# Altium schematic sheet STM32F407 MCU.SchDoc
size A4; SheetNumber: 8; SheetTotal: 10
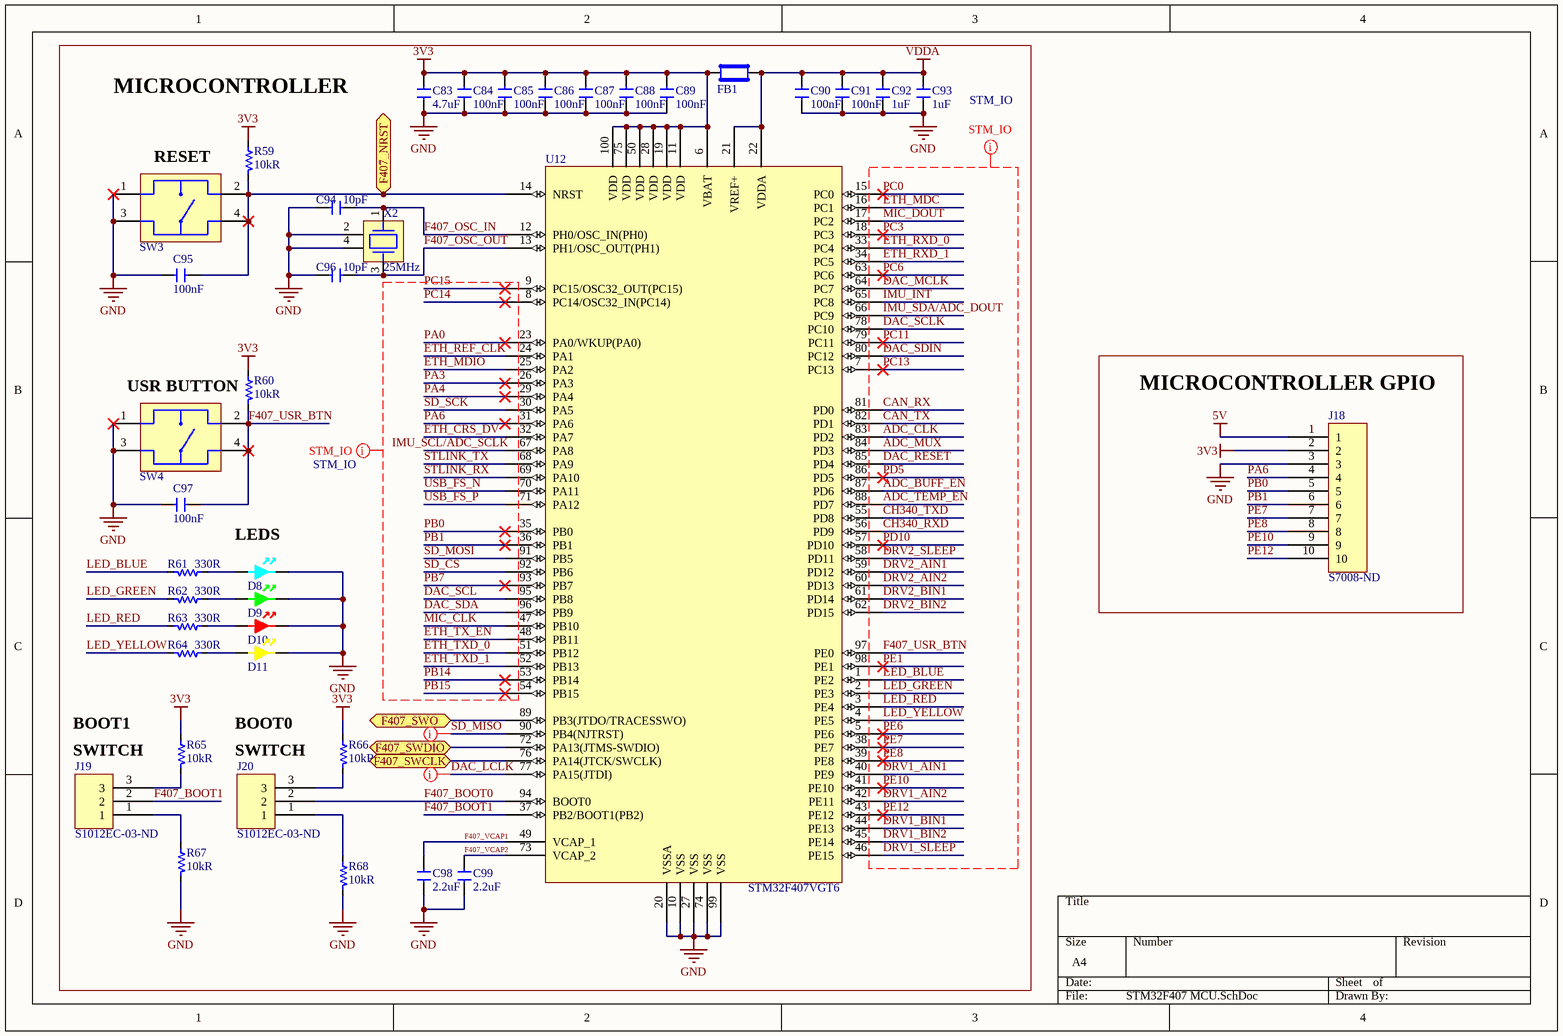
[diagram p0: STM32F407 MCU.SchDoc]

## Parts
C83  Capacitance: 4.7uF  [0805_CAP]  (hidden comment: CAP_4.7uF_%10_0805_25V_X7R_CER)
C84  Capacitance: 100nF  [0805_CAP]  (hidden comment: CAP_0.1uF_%20_50V_0805_X7R_CER)
C85  Capacitance: 100nF  [0805_CAP]  (hidden comment: CAP_0.1uF_%20_50V_0805_X7R_CER)
C86  Capacitance: 100nF  [0805_CAP]  (hidden comment: CAP_0.1uF_%20_50V_0805_X7R_CER)
C87  Capacitance: 100nF  [0805_CAP]  (hidden comment: CAP_0.1uF_%20_50V_0805_X7R_CER)
C88  Capacitance: 100nF  [0805_CAP]  (hidden comment: CAP_0.1uF_%20_50V_0805_X7R_CER)
C89  Capacitance: 100nF  [0805_CAP]  (hidden comment: CAP_0.1uF_%20_50V_0805_X7R_CER)
C90  Capacitance: 100nF  [0805_CAP]  (hidden comment: CAP_0.1uF_%20_50V_0805_X7R_CER)
C91  Capacitance: 100nF  [0805_CAP]  (hidden comment: CAP_0.1uF_%20_50V_0805_X7R_CER)
C92  1uF  [0805_CAP]
C93  1uF  [0805_CAP]
C94  Capacitance: 10pF  [0805_CAP]  (hidden comment: CAP_10pF_%10_0805_50V_C0G/NPO_CER)
C95  Capacitance: 100nF  [0805_CAP]  (hidden comment: CAP_100nF_50V_0805_C0G_CER)
C96  Capacitance: 10pF  [0805_CAP]  (hidden comment: CAP_10pF_%10_0805_50V_C0G/NPO_CER)
C97  Capacitance: 100nF  [0805_CAP]  (hidden comment: CAP_100nF_50V_0805_C0G_CER)
C98  2.2uF  [0805_CAP]
C99  2.2uF  [0805_CAP]
D8  Blue  [DIOC2114X07N-0805-LED-BLUE]  (value not drawn)
D9  Green  [DIOC2114X07N-0805-LED-GREEN]  (value not drawn)
D10  Red  [DIOC2114X07N-0805-LED-RED]  (value not drawn)
D11  Yellow  [DIOC2114X07N-0805-LED-YELLOW]  (value not drawn)
FB1  FERRITE BEAD_330 OHM_70 mOHM DCR_0805_1LN  [0805_FB]  (value not drawn)
J18  Supplier Part Number 1: S7008-ND  [DIP_1X10_FEMALE_HEADER_2.54_PITCH]  (hidden comment: 1x10-Male Header)
J19  Supplier Part Number 1: S1012EC-03-ND  [DIP_1X3_MALE_HEADER_2.54_PITCH]  (hidden comment: CONN_1X3_2.54mm_Male Header)
J20  Supplier Part Number 1: S1012EC-03-ND  [DIP_1X3_MALE_HEADER_2.54_PITCH]  (hidden comment: CONN_1X3_2.54mm_Male Header)
R59  Resistance: 10kR  [0805_RES]  (hidden comment: 10k Ohms)
R60  Resistance: 10kR  [0805_RES]  (hidden comment: 10k Ohms)
R61  Resistance: 330R  [0805_RES]  (hidden comment: RES_330 OHM_5%_0805_1/8W)
R62  Resistance: 330R  [0805_RES]  (hidden comment: RES_330 OHM_5%_0805_1/8W)
R63  Resistance: 330R  [0805_RES]  (hidden comment: RES_330 OHM_5%_0805_1/8W)
R64  Resistance: 330R  [0805_RES]  (hidden comment: RES_330 OHM_5%_0805_1/8W)
R65  Resistance: 10kR  [0805_RES]  (hidden comment: 10k Ohms)
R66  Resistance: 10kR  [0805_RES]  (hidden comment: 10k Ohms)
R67  Resistance: 10kR  [0805_RES]  (hidden comment: 10k Ohms)
R68  Resistance: 10kR  [0805_RES]  (hidden comment: 10k Ohms)
SW3  SWITCH_TACTILE_SPST-NO_0.05A_12V  [TACT_SWITCH_6MMX6MM]  (value not drawn)
SW4  SWITCH_TACTILE_SPST-NO_0.05A_12V  [TACT_SWITCH_6MMX6MM]  (value not drawn)
U12  STM32F407VGT6  [STM32F407_LQFP50P1600X1600X160-100N]
X2  25MHz  [4-SMD-ABM8G-25.000MHZ-4Y-T3]

## Blocks framed on the sheet
MICROCONTROLLER: C83-C99 D8-D11 FB1 J19 J20 R59-R68 SW3 SW4 U12 X2
MICROCONTROLLER GPIO: J18

## Ports
F407_NRST (bidir), F407_SWCLK (bidir), F407_SWDIO (bidir), F407_SWO (bidir)

## Nets
3V3: C83.2 C84.2 C85.2 C86.2 C87.2 C88.2 C89.2 FB1.1 J18.2 R59.2 R60.2 R65.2 R66.2 U12.6(VBAT) U12.11(VDD) U12.19(VDD) U12.28(VDD) U12.50(VDD) U12.75(VDD) U12.100(VDD)
5V: J18.1
GND: C83.1 C84.1 C85.1 C86.1 C87.1 C88.1 C89.1 C90.1 C91.1 C92.1 C93.1 C94.1 C95.2 C96.1 C97.2 C98.1 C99.1 D8.1(CATHODE) D9.1(CATHODE) D10.1(CATHODE) D11.1(CATHODE) J18.3 R67.1 R68.1 SW3.1 SW3.3 SW4.1 SW4.3 U12.10(VSS) U12.20(VSSA) U12.27(VSS) U12.74(VSS) U12.99(VSS) X2.2(GND) X2.4(GND)
VDDA: C90.2 C91.2 C92.2 C93.2 FB1.2 U12.21(VREF+) U12.22(VDDA)
ADC_BUFF_EN: U12.87(PD6)
ADC_CLK: U12.83(PD2)
ADC_MUX: U12.84(PD3)
ADC_TEMP_EN: U12.88(PD7)
CAN_RX: U12.81(PD0)
CAN_TX: U12.82(PD1)
CH340_RXD: U12.56(PD9)
CH340_TXD: U12.55(PD8)
DAC_LCLK: U12.77(PA15(JTDI))
DAC_MCLK: U12.64(PC7)
DAC_RESET: U12.85(PD4)
DAC_SCL: U12.95(PB8)
DAC_SCLK: U12.78(PC10)
DAC_SDA: U12.96(PB9)
DAC_SDIN: U12.80(PC12)
DRV1_AIN1: U12.40(PE9)
DRV1_AIN2: U12.42(PE11)
DRV1_BIN1: U12.44(PE13)
DRV1_BIN2: U12.45(PE14)
DRV1_SLEEP: U12.46(PE15)
DRV2_AIN1: U12.59(PD12)
DRV2_AIN2: U12.60(PD13)
DRV2_BIN1: U12.61(PD14)
DRV2_BIN2: U12.62(PD15)
DRV2_SLEEP: U12.58(PD11)
ETH_CRS_DV: U12.32(PA7)
ETH_MDC: U12.16(PC1)
ETH_MDIO: U12.25(PA2)
ETH_REF_CLK: U12.24(PA1)
ETH_RXD_0: U12.33(PC4)
ETH_RXD_1: U12.34(PC5)
ETH_TX_EN: U12.48(PB11)
ETH_TXD_0: U12.51(PB12)
ETH_TXD_1: U12.52(PB13)
F407_BOOT0: J20.2 U12.94(BOOT0)
F407_BOOT1: J19.2 U12.37(PB2/BOOT1(PB2))
F407_NRST: C95.1 R59.1 SW3.2 SW3.4 U12.14(NRST) ; port F407_NRST
F407_OSC_IN: C94.2 U12.12(PH0/OSC_IN(PH0)) X2.1
F407_OSC_OUT: C96.2 U12.13(PH1/OSC_OUT(PH1)) X2.3
F407_SWCLK: U12.76(PA14(JTCK/SWCLK)) ; port F407_SWCLK
F407_SWDIO: U12.72(PA13(JTMS-SWDIO)) ; port F407_SWDIO
F407_SWO: U12.89(PB3(JTDO/TRACESSWO)) ; port F407_SWO
F407_USR_BTN: C97.1 R60.1 SW4.2 SW4.4 U12.97(PE0)
F407_VCAP1: C98.2 U12.49(VCAP_1)
F407_VCAP2: C99.2 U12.73(VCAP_2)
IMU_INT: U12.65(PC8)
IMU_SCL/ADC_SCLK: U12.67(PA8)
IMU_SDA/ADC_DOUT: U12.66(PC9)
LED_BLUE: R61.1 U12.1(PE2)
LED_GREEN: R62.1 U12.2(PE3)
LED_RED: R63.1 U12.3(PE4)
LED_YELLOW: R64.1 U12.4(PE5)
MIC_CLK: U12.47(PB10)
MIC_DOUT: U12.17(PC2)
PA0: U12.23(PA0/WKUP(PA0))
PA3: U12.26(PA3)
PA4: U12.29(PA4)
PA6: J18.4 U12.31(PA6)
PB0: J18.5 U12.35(PB0)
PB1: J18.6 U12.36(PB1)
PB7: U12.93(PB7)
PB14: U12.53(PB14)
PB15: U12.54(PB15)
PC0: U12.15(PC0)
PC3: U12.18(PC3)
PC6: U12.63(PC6)
PC11: U12.79(PC11)
PC13: U12.7(PC13)
PC14: U12.8(PC14/OSC32_IN(PC14))
PC15: U12.9(PC15/OSC32_OUT(PC15))
PD5: U12.86(PD5)
PD10: U12.57(PD10)
PE1: U12.98(PE1)
PE6: U12.5(PE6)
PE7: J18.7 U12.38(PE7)
PE8: J18.8 U12.39(PE8)
PE10: J18.9 U12.41(PE10)
PE12: J18.10 U12.43(PE12)
SD_CS: U12.92(PB6)
SD_MISO: U12.90(PB4(NJTRST))
SD_MOSI: U12.91(PB5)
SD_SCK: U12.30(PA5)
STLINK_RX: U12.69(PA10)
STLINK_TX: U12.68(PA9)
USB_FS_N: U12.70(PA11)
USB_FS_P: U12.71(PA12)
NetD8_2: D8.2(ANODE) R61.2
NetD9_2: D9.2(ANODE) R62.2
NetD10_2: D10.2(ANODE) R63.2
NetD11_2: D11.2(ANODE) R64.2
NetJ19_1: J19.1 R67.2
NetJ19_3: J19.3 R65.1
NetJ20_1: J20.1 R68.2
NetJ20_3: J20.3 R66.1

## Layout directives
net class STM_IO: ADC_BUFF_EN, ADC_CLK, ADC_MUX, ADC_TEMP_EN, CAN_RX, CAN_TX, CH340_RXD, CH340_TXD, DAC_LCLK, DAC_MCLK, DAC_RESET, DAC_SCL, DAC_SCLK, DAC_SDA, DAC_SDIN, DRV1_AIN1, DRV1_AIN2, DRV1_BIN1, DRV1_BIN2, DRV1_SLEEP, DRV2_AIN1, DRV2_AIN2, DRV2_BIN1, DRV2_BIN2, DRV2_SLEEP, ETH_CRS_DV, ETH_MDC, ETH_MDIO, ETH_REF_CLK, ETH_RXD_0, ETH_RXD_1, ETH_TX_EN, ETH_TXD_0, ETH_TXD_1, F407_USR_BTN, IMU_INT, IMU_SCL/ADC_SCLK, IMU_SDA/ADC_DOUT, LED_BLUE, LED_GREEN, LED_RED, LED_YELLOW, MIC_CLK, MIC_DOUT, PA0, PA3, PA4, PA6, PB0, PB1, PB7, PB14, PB15, PC0, PC3, PC6, PC11, PC13, PC14, PC15, PD5, PD10, PE1, PE6, PE7, PE8, PE10, PE12, SD_CS, SD_MISO, SD_MOSI, SD_SCK, STLINK_RX, STLINK_TX, USB_FS_N, USB_FS_P

## Notes on the sheet
- (near SW3) RESET
- USR BUTTON
- LEDS
- BOOT1
- (near J19) SWITCH
- BOOT0
- (near J20) SWITCH

## Library data of the parts
C83 = CAP_4.7uF_%10_0805_25V_X7R_CER: Cap 4.7UF 25VDC X7R 10% SMD 0805 Embossed Tape; Manufacturer: Murata; Manufacturer Part Number: GRM21BZ71E475KE15L; Supplier 1: Digi-Key; RoHS: Yes; Category: Ceramic Capacitors; Stock 1: 16381; Pricing 1: 1=0,35000, 10=0,24300, 50=0,16980, 100=0,14550, 500=0,10914, 1000=0,09217 (USD); RoHS Compliant: Yes; Supplier Part Number 1: 490-GRM21BZ71E475KE15LCT-ND
C84-C91 = CAP_0.1uF_%20_50V_0805_X7R_CER: Cap Ceramic 0.1uF 50V X7R 20% SMD 0805 125C Paper T/R; Manufacturer: KEMET; Manufacturer Part Number: C0805C104M5RACTU; Supplier 1: Digi-Key; RoHS: Yes; Category: Ceramic Capacitors; Stock 1: 4863; Pricing 1: 1=0,10000, 10=0,06400, 50=0,03500, 100=0,02860, 500=0,02040, 1000=0,01603 (USD); Mount: Surface Mount; Case/Package: 0805; Dielectric Material: Ceramic; Min Operating Temperature: -55°C; Max Operating Temperature: 125°C; Tolerance: 20%; Dielectric: X7R; Packaging: Tape and Reel; Voltage Rating (DC): 50V; Length: 2mm; Height: 0.9mm; Depth: 1.25mm; Radiation Hardening: No; ComponentLink1URL: http://uk.rs-online.com/webdocs/13da/0900766b813daa06.pdf?src-supplier=RSComponents; ComponentLink1Description: http://uk.rs-online.com/webdocs/13da/0900766b813daa06.pdf?src-supplier=RSComponents; ComponentLink2URL: https://www.verical.com/server-webapp/html/getDatasheet?partID=774625&src-supplier=Verical; ComponentLink2Description: https://www.verical.com/server-webapp/html/getDatasheet?partID=774625&src-supplier=Verical; ComponentLink3URL: http://www.farnell.com/datasheets/2739857.pdf?src-supplier=Farnell; ComponentLink3Description: http://www.farnell.com/datasheets/2739857.pdf?src-supplier=Farnell; ComponentLink4URL: http://uk.rs-online.com/webdocs/1515/0900766b81515223.pdf?src-supplier=RSComponents; ComponentLink4Description: http://uk.rs-online.com/webdocs/1515/0900766b81515223.pdf?src-supplier=RSComponents; ComponentLink5URL: http://components.arrow.com/part/dataview/0323_00324812?src-supplier=Arrow+Europe; ComponentLink5Description: http://components.arrow.com/part/dataview/0323_00324812?src-supplier=Arrow+Europe; ComponentLink6URL: http://uk.rs-online.com/webdocs/1528/0900766b81528e2f.pdf?src-supplier=RSComponents; ComponentLink6Description: http://uk.rs-online.com/webdocs/1528/0900766b81528e2f.pdf?src-supplier=RSComponents; ComponentLink7URL: http://www.farnell.com/datasheets/2739857.pdf?src-supplier=Newark; ComponentLink7Description: http://www.farnell.com/datasheets/2739857.pdf?src-supplier=Newark; ComponentLink8URL: http://www.alliedelec.com/m/d/9bfe7773041ffe9d406e68bc7b377fdd.pdf?src-supplier=Allied+Electronics; ComponentLink8Description: http://www.alliedelec.com/m/d/9bfe7773041ffe9d406e68bc7b377fdd.pdf?src-supplier=Allied+Electronics; ComponentLink9URL: https://api.kemet.com/component-edge/download/datasheet/C0805C104M5RACTU.pdf?src-supplier=Digi-Key; ComponentLink9Description: https://api.kemet.com/component-edge/download/datasheet/C0805C104M5RACTU.pdf?src-supplier=Digi-Key; ComponentLink10URL: http://capacitoredge.kemet.com/capedge2/DataSheet?pn=C0805C104M5RACTU&src-supplier=Avnet+Europe; ComponentLink10Description: http://capacitoredge.kemet.com/capedge2/DataSheet?pn=C0805C104M5RACTU&src-supplier=Avnet+Europe; ComponentLink11URL: http://www.farnell.com/datasheets/2739857.pdf?src-supplier=Element14; ComponentLink11Description: http://www.farnell.com/datasheets/2739857.pdf?src-supplier=Element14; ComponentLink12URL: http://www.mouser.com/ds/2/212/KEM_C1002_X7R_SMD-1102033.pdf?src-supplier=Mouser; ComponentLink12Description: http://www.mouser.com/ds/2/212/KEM_C1002_X7R_SMD-1102033.pdf?src-supplier=Mouser; ComponentLink13URL: https://www.verical.com/server-webapp/html/getDatasheet?partID=91523&src-supplier=Verical; ComponentLink13Description: https://www.verical.com/server-webapp/html/getDatasheet?partID=91523&src-supplier=Verical; ComponentLink14URL: http://components.arrow.com/part/dataview/2091108S8109171N7429?src-supplier=Arrow+Electronics; ComponentLink14Description: http://components.arrow.com/part/dataview/2091108S8109171N7429?src-supplier=Arrow+Electronics; Supplier Part Number 1: 399-C0805C104M5RAC7800CT-ND
C92 C93 = CAP_1uF_%10_25V_0805_X7R_CER: 陶瓷电容 1uF(105) 1uF ±10% 25V 0805; Manufacturer: Samsung; Manufacturer Part Number: CL21B105KAFNNNG; Material: Ceramic; Dielectric: X7R; Supplier 1: Digi-Key; RoHS: Yes; Category: Ceramic Capacitors; Stock 1: 509034; Pricing 1: 1=0,10000, 10=0,07100, 50=0,03880, 100=0,03170, 500=0,02264, 1000=0,01779 (USD); Mount: Surface Mount; Case/Package: 0805; Case Code (Metric): 2012; Case Code (Imperial): 0805; Min Operating Temperature: -55°C; Max Operating Temperature: 125°C; Tolerance: 10%; Capacitance: 1uF; Voltage Rating: 25V; Package Quantity: 3000; Packaging: Tape and Reel; Voltage: 25V; Series: CL; Length: 2mm; Width: 0.049inch; Height: 1.25mm; Thickness: 0.053inch; Depth: 1.25mm; Radiation Hardening: No; RoHS Compliant: Yes; ComponentLink1URL: https://datasheet.ciiva.com/26920/getdatasheetpartid-698495-26920200.pdf?src-supplier=Verical; ComponentLink1Description: https://datasheet.ciiva.com/26920/getdatasheetpartid-698495-26920200.pdf?src-supplier=Verical; ComponentLink2URL: https://datasheet.ciiva.com/29199/455911-da-01-en-vs-kondensator-0805-29199043.pdf?src-supplier=Conrad; ComponentLink2Description: https://datasheet.ciiva.com/29199/455911-da-01-en-vs-kondensator-0805-29199043.pdf?src-supplier=Conrad; ComponentLink3URL: https://datasheet.ciiva.com/16428/cl05b104kq5nnnc-16428871.pdf?src-supplier=Future+Electronics; ComponentLink3Description: https://datasheet.ciiva.com/16428/cl05b104kq5nnnc-16428871.pdf?src-supplier=Future+Electronics; Supplier Part Number 1: 1276-6469-1-ND
C94 C96 = CAP_10pF_%10_0805_50V_C0G/NPO_CER: Surface Mount Ceramic Multilayer Capacitor 10pF 10% C0G 50V 0805 Paper T/R; Manufacturer: Yageo; Manufacturer Part Number: CC0805KRNPO9BN100; Supplier 1: Digi-Key; RoHS: Yes; Category: Ceramic Capacitors; Stock 1: 35719; Pricing 1: 1=0,12000, 10=0,08800, 50=0,04980, 100=0,04130, 500=0,02898, 1000=0,02400 (USD); RoHS Compliant: Yes; Supplier Part Number 1: 13-CC0805KRNPO9BN100CT-ND
C95 C97 = CAP_100nF_50V_0805_C0G_CER: Cap Ceramic 0.1uF 50V X7R 20% SMD 0805 125C Paper T/R; Manufacturer: KEMET; Manufacturer Part Number: C0805C104M5RACTU; Supplier 1: Digi-Key; RoHS: Yes; Category: Ceramic Capacitors; Stock 1: 4863; Pricing 1: 1=0,10000, 10=0,06400, 50=0,03500, 100=0,02860, 500=0,02040, 1000=0,01603 (USD); Mount: Surface Mount; Case/Package: 0805; Dielectric Material: Ceramic; Min Operating Temperature: -55°C; Max Operating Temperature: 125°C; Tolerance: 20%; Packaging: Tape and Reel; Dielectric: X7R; Voltage Rating (DC): 50V; Length: 2mm; Height: 0.9mm; Depth: 1.25mm; Radiation Hardening: No; ComponentLink1URL: http://uk.rs-online.com/webdocs/13da/0900766b813daa06.pdf?src-supplier=RSComponents; ComponentLink1Description: http://uk.rs-online.com/webdocs/13da/0900766b813daa06.pdf?src-supplier=RSComponents; ComponentLink2URL: http://uk.rs-online.com/webdocs/1515/0900766b81515223.pdf?src-supplier=RSComponents; ComponentLink2Description: http://uk.rs-online.com/webdocs/1515/0900766b81515223.pdf?src-supplier=RSComponents; ComponentLink3URL: http://www.farnell.com/datasheets/2739857.pdf?src-supplier=Farnell; ComponentLink3Description: http://www.farnell.com/datasheets/2739857.pdf?src-supplier=Farnell; ComponentLink4URL: http://components.arrow.com/part/dataview/0323_00324812?src-supplier=Arrow+Europe; ComponentLink4Description: http://components.arrow.com/part/dataview/0323_00324812?src-supplier=Arrow+Europe; ComponentLink5URL: http://uk.rs-online.com/webdocs/1528/0900766b81528e2f.pdf?src-supplier=RSComponents; ComponentLink5Description: http://uk.rs-online.com/webdocs/1528/0900766b81528e2f.pdf?src-supplier=RSComponents; ComponentLink6URL: http://www.farnell.com/datasheets/2739857.pdf?src-supplier=Newark; ComponentLink6Description: http://www.farnell.com/datasheets/2739857.pdf?src-supplier=Newark; ComponentLink7URL: https://api.kemet.com/component-edge/download/datasheet/C0805C104M5RACTU.pdf?src-supplier=Digi-Key; ComponentLink7Description: https://api.kemet.com/component-edge/download/datasheet/C0805C104M5RACTU.pdf?src-supplier=Digi-Key; ComponentLink8URL: http://www.farnell.com/datasheets/2739857.pdf?src-supplier=Element14; ComponentLink8Description: http://www.farnell.com/datasheets/2739857.pdf?src-supplier=Element14; ComponentLink9URL: http://www.alliedelec.com/m/d/9bfe7773041ffe9d406e68bc7b377fdd.pdf?src-supplier=Allied+Electronics; ComponentLink9Description: http://www.alliedelec.com/m/d/9bfe7773041ffe9d406e68bc7b377fdd.pdf?src-supplier=Allied+Electronics; ComponentLink10URL: http://www.mouser.com/ds/2/212/KEM_C1002_X7R_SMD-1102033.pdf?src-supplier=Mouser; ComponentLink10Description: http://www.mouser.com/ds/2/212/KEM_C1002_X7R_SMD-1102033.pdf?src-supplier=Mouser; ComponentLink11URL: http://capacitoredge.kemet.com/capedge2/DataSheet?pn=C0805C104M5RACTU&src-supplier=Avnet+Europe; ComponentLink11Description: http://capacitoredge.kemet.com/capedge2/DataSheet?pn=C0805C104M5RACTU&src-supplier=Avnet+Europe; Supplier Part Number 1: 399-C0805C104M5RAC7800CT-ND
C98 C99 = CAP_2.2uF_%10_25V_0805_X5R_CER: CAP CER 2.2UF 25V X5R 0805; Manufacturer: Samsung; Manufacturer Part Number: CL21A225KAFNNNE; Tolerance: 10%; Supplier 1: Digi-Key; RoHS: Yes; Category: Ceramic Capacitors; Stock 1: 282255; Pricing 1: 1=0,13000, 10=0,09300, 50=0,05280, 100=0,04380, 500=0,03070, 1000=0,02541 (USD); Mount: Surface Mount; Case/Package: 0805; Case Code (Metric): 2012; Case Code (Imperial): 0805; Min Operating Temperature: -55°C; Max Operating Temperature: 85°C; Capacitance: 2.2uF; Packaging: Tape and Reel; Package Quantity: 1; Voltage Rating: 25V; Dielectric: X5R; Series: CL; Construction: Flat; Length: 2mm; Width: 0.049inch; Height: 1.25mm; Thickness: 0.053inch; Depth: 1.25mm; Radiation Hardening: No; RoHS Compliant: Yes; ComponentLink1URL: https://datasheet.ciiva.com/25798/cl21a225kafnnne-25798496.pdf?src-supplier=Digi-Key; ComponentLink1Description: https://datasheet.ciiva.com/25798/cl21a225kafnnne-25798496.pdf?src-supplier=Digi-Key; ComponentLink2URL: https://datasheet.ciiva.com/16425/samsung20passive20cl21a225kafnnne-16425804.pdf?src-supplier=Future+Electronics; ComponentLink2Description: https://datasheet.ciiva.com/16425/samsung20passive20cl21a225kafnnne-16425804.pdf?src-supplier=Future+Electronics; ComponentLink3URL: https://datasheet.ciiva.com/26838/getdatasheetpartid-745307-26838602.pdf?src-supplier=Verical; ComponentLink3Description: https://datasheet.ciiva.com/26838/getdatasheetpartid-745307-26838602.pdf?src-supplier=Verical; Supplier Part Number 1: 1276-1763-1-ND
D8 = LED_BLUE CLEAR_2SMD/0805: Blue 0805 140° 112 mcd Clear 3.3 V Surface Mount LED; Manufacturer: Everlight; Manufacturer Part Number: EAST2012BA2; Lens Color: Colorless; Luminous Intensity: 79mcd; Test Current: 20mA; Dominant Wavelength: 471nm; Forward Voltage: 3.3V; Supplier 1: Digi-Key; RoHS: Yes; Category: LEDs; Pricing 1: 9000=0,05724 (USD); Mount: Surface Mount; Case/Package: 0805; Color: Blue; Packaging: Tape and Reel; Lens Transparency: Clear; Viewing Angle: 140°; Length: 2mm; Width: 1.25mm; Height: 1.1mm; Lead Free: Lead Free; RoHS Compliant: Yes; ComponentLink1URL: http://www.mouser.com/ds/2/143/EAST2012BA2-707392.pdf?src-supplier=Mouser; ComponentLink1Description: http://www.mouser.com/ds/2/143/EAST2012BA2-707392.pdf?src-supplier=Mouser; ComponentLink2URL: https://everlightamericas.com/index.php?controller=attachment&id_attachment=1036&src-supplier=Digi-Key; ComponentLink2Description: https://everlightamericas.com/index.php?controller=attachment&id_attachment=1036&src-supplier=Digi-Key; Supplier Part Number 1: EAST2012BA2-ND
D9 = LED_GREEN CLEAR_2SMD/0805: Led Green Clear 2SMD; Manufacturer: Everlight; Manufacturer Part Number: EAST2012GA5; Lens Color: Colorless; Luminous Intensity: 315mcd; Test Current: 20mA; Viewing Angle: 140°; Dominant Wavelength: 523nm; Forward Voltage: 3.4V; Supplier 1: Digi-Key; Category: LEDs; Stock 1: 15531; Pricing 1: 1=0,44000, 10=0,29000, 100=0,19380, 500=0,13406, 1000=0,11172 (USD); Mount: Surface Mount; Case/Package: 0805; Color: Green; Packaging: Tape and Reel; Lens Transparency: Clear; Length: 2mm; Width: 1.25mm; Height: 1mm; RoHS Compliant: Yes; ComponentLink1URL: http://www.mouser.com/ds/2/143/EAST2012GA5-707028.pdf?src-supplier=Mouser; ComponentLink1Description: http://www.mouser.com/ds/2/143/EAST2012GA5-707028.pdf?src-supplier=Mouser; ComponentLink2URL: https://everlightamericas.com/index.php?controller=attachment&id_attachment=1042&src-supplier=Digi-Key; ComponentLink2Description: https://everlightamericas.com/index.php?controller=attachment&id_attachment=1042&src-supplier=Digi-Key; Supplier Part Number 1: 1080-EAST2012GA5CT-ND
D10 = LED_RED CLEAR_2SMD/0805: Led Red Clear 2SMD; Manufacturer: Everlight; Manufacturer Part Number: EAST2012RA1; Lens Color: Colorless; Luminous Intensity: 79mcd; Test Current: 20mA; Viewing Angle: 120°; Dominant Wavelength: 626nm; Forward Voltage: 2V; Supplier 1: Digi-Key; Category: LEDs; Stock 1: 154; Pricing 1: 1=0,23000, 10=0,12300, 100=0,05840, 500=0,04996, 1000=0,03842 (USD); Mount: Surface Mount; Case/Package: 0805; Color: Red; Packaging: Tape and Reel; Lens Transparency: Clear; Length: 2mm; Width: 1.25mm; Height: 1mm; RoHS Compliant: Yes; ComponentLink1URL: http://www.mouser.com/ds/2/143/EAST2012RA1-707412.pdf?src-supplier=Mouser; ComponentLink1Description: http://www.mouser.com/ds/2/143/EAST2012RA1-707412.pdf?src-supplier=Mouser; ComponentLink2URL: https://everlightamericas.com/index.php?controller=attachment&id_attachment=1047&src-supplier=Digi-Key; ComponentLink2Description: https://everlightamericas.com/index.php?controller=attachment&id_attachment=1047&src-supplier=Digi-Key; Supplier Part Number 1: 1080-EAST2012RA1CT-ND
D11 = LED_YELLOW CLEAR_2SMD/0805: Led Yellow Clear 2SMD; Manufacturer: Everlight; Manufacturer Part Number: EAST2012YA2; Lens Color: Colorless; Luminous Intensity: 85mcd; Test Current: 20mA; Viewing Angle: 140°; Dominant Wavelength: 589nm; Forward Voltage: 2.05V; Supplier 1: Digi-Key; RoHS: Yes; Category: LEDs; Stock 1: 9683; Pricing 1: 1=0,29000, 10=0,22600, 100=0,10150, 500=0,09172, 1000=0,07533 (USD); Mount: Surface Mount; Case/Package: 0805; Color: Yellow; Packaging: Tape and Reel; Lens Transparency: Clear; Length: 2mm; Width: 1.25mm; Height: 1.1mm; ComponentLink1URL: http://www.mouser.com/ds/2/143/EAST2012YA2-708101.pdf?src-supplier=Mouser; ComponentLink1Description: http://www.mouser.com/ds/2/143/EAST2012YA2-708101.pdf?src-supplier=Mouser; ComponentLink2URL: https://everlightamericas.com/index.php?controller=attachment&id_attachment=1054&src-supplier=Digi-Key; ComponentLink2Description: https://everlightamericas.com/index.php?controller=attachment&id_attachment=1054&src-supplier=Digi-Key; Supplier Part Number 1: 1080-EAST2012YA2CT-ND; RoHS Compliant: Yes
FB1 = FERRITE BEAD_330 OHM_70 mOHM DCR_0805_1LN: 0805 330Ω ±25% DCR=0.07Ω 1.5A 应用：电源线; Manufacturer: Murata; Manufacturer Part Number: BLM21PG331SN1D; Material: Steel,Ferrite; Impedance: 330R; DC Resistance (DCR): 70mR; Number of Lines: 1; Shielding: Unshielded; Resistance: 90mR; Test Frequency: 100MHz; Supplier 1: Digi-Key; RoHS: Yes; Category: Ferrite Beads and Chips; Stock 1: 511995; Pricing 1: 1=0,13000, 10=0,10300, 25=0,09320, 50=0,06820, 100=0,05890, 250=0,04652, 500=0,03930, 1000=0,03309 (USD); Case/Package: 0805; Number of Pins: 2; Core Material: Ferrite; Case Code (Metric): 2012; Case Code (Imperial): 0805; Min Operating Temperature: -55°C; Max Operating Temperature: 125°C; Packaging: Tape and Reel; Current Rating: 1.5A; Number of Circuits: 1; Tolerance: 25%; Package Quantity: 1; Max Current Rating: 1.5A; Max DC Current: 1.5A; Termination: SMD/SMT; DC Current: 1.5A; Series: BLM21P; Length: 2mm; Width: 1.25mm; Height: 0.85mm; Depth: 1.25mm; Radiation Hardening: No; REACH SVHC: No SVHC; Lead Free: Lead Free; RoHS Compliant: Yes; ComponentLink1URL: https://datasheet.ciiva.com/19460/1845347-19460239.pdf?src-supplier=Jameco; ComponentLink1Description: https://datasheet.ciiva.com/19460/1845347-19460239.pdf?src-supplier=Jameco; ComponentLink2URL: https://datasheet.ciiva.com/11799/0900766b81275e31-11799231.pdf?src-supplier=RSComponents; ComponentLink2Description: https://datasheet.ciiva.com/11799/0900766b81275e31-11799231.pdf?src-supplier=RSComponents; ComponentLink3URL: https://datasheet.ciiva.com/14122/anblm21p-data-e-14122215.pdf?src-supplier=Distrelec; ComponentLink3Description: https://datasheet.ciiva.com/14122/anblm21p-data-e-14122215.pdf?src-supplier=Distrelec; ComponentLink4URL: https://datasheet.ciiva.com/6211/l0110s0100blm21p-6211753.pdf?src-supplier=Digi-Key; ComponentLink4Description: https://datasheet.ciiva.com/6211/l0110s0100blm21p-6211753.pdf?src-supplier=Digi-Key; ComponentLink5URL: https://datasheet.ciiva.com/6211/l0110s0100blm21p-6211749.pdf?src-supplier=Digi-Key; ComponentLink5Description: https://datasheet.ciiva.com/6211/l0110s0100blm21p-6211749.pdf?src-supplier=Digi-Key; ComponentLink6URL: https://datasheet.ciiva.com/6211/l0110s0100blm21p-6211754.pdf?src-supplier=Digi-Key; ComponentLink6Description: https://datasheet.ciiva.com/6211/l0110s0100blm21p-6211754.pdf?src-supplier=Digi-Key; ComponentLink7URL: https://datasheet.ciiva.com/3081/l0110s0100blm21p-3081659.pdf?src-supplier=Avnet; ComponentLink7Description: https://datasheet.ciiva.com/3081/l0110s0100blm21p-3081659.pdf?src-supplier=Avnet; ComponentLink8URL: https://datasheet.ciiva.com/41449/001172367-da-01-en-drossel-0805-330r-2-0x1-25mm-4000st-41449610.pdf?src-supplier=Conrad; ComponentLink8Description: https://datasheet.ciiva.com/41449/001172367-da-01-en-drossel-0805-330r-2-0x1-25mm-4000st-41449610.pdf?src-supplier=Conrad; Supplier Part Number 1: 490-5988-1-ND
J18 = CONN_1x10_2.54m_Female Header: 10 Position Single Row 2.54 mm Pitch Vertical Through Hole Socket Header; Manufacturer: Sullins; Manufacturer Part Number: PPTC101LFBN-RC; Number of Positions: 10; Pitch: 0.1inch; Supplier 1: Digi-Key; RoHS: Yes; Category: Connectors; Stock 1: 16929; Pricing 1: 1=0,65000, 10=0,55100, 320=0,45000, 640=0,40500, 960=0,36000, 5120=0,32500 (USD); Mount: Through Hole; Color: Black; Contact Plating: Tin; Contact Material: Bronze; Housing Material: Plastic; Package Quantity: 1000; Number of Rows: 1; Packaging: Bulk; Termination: Solder; Connector Type: Header; Contact Type: Female Socket; Length: 25.9mm; Width: 2.5mm; Height: 8.5mm; Lead Free: Lead Free; RoHS Compliant: Yes; ComponentLink1URL: https://media.digikey.com/pdf/Data%20Sheets/Sullins%20PDFs/Female_Headers.100_DS.pdf?src-supplier=Digi-Key; ComponentLink1Description: https://media.digikey.com/pdf/Data%20Sheets/Sullins%20PDFs/Female_Headers.100_DS.pdf?src-supplier=Digi-Key
J19 J20 = CONN_1X3_2.54mm_Male Header: Conn Header Vert 3POS 2.54MM; Manufacturer: Sullins; Manufacturer Part Number: PREC003SAAN-RC; Number of Positions: 3; Connector Type: Male Pin; Pitch: 0.1inch; Supplier 1: Digi-Key; RoHS: Yes; Category: Connectors; Stock 1: 15048; Pricing 1: 1=0,09000, 10=0,08400, 25=0,06240, 50=0,05340, 100=0,05170, 250=0,04456, 500=0,04276 (USD); Mount: Through Hole; Color: Black; Contact Plating: Tin; Package Quantity: 1; Number of Rows: 1; Packaging: Bulk; Termination: Solder; Series: -; Contact Type: Male Pin; Contact Mating Length: 0.23inch; RoHS Compliant: Yes; ComponentLink1URL: https://datasheet.ciiva.com/740/zrzczzzszzn-rc-st-11635-b-740842.pdf?src-supplier=Digi-Key; ComponentLink1Description: https://datasheet.ciiva.com/740/zrzczzzszzn-rc-st-11635-b-740842.pdf?src-supplier=Digi-Key
R59 R60 R65-R68 = RES_10K OHM_%1_0805_1/8W: Res SMD 0805 10K 1% 0.125W T.C.100PPM; Manufacturer: TDK; Manufacturer Part Number: C2012X7R1H104K085AA; Dielectric Material: Ceramic; Capacitance: 100nF; Tolerance: 10%; Dielectric: X7R; Voltage Rating: 50V; Temperature Coefficient: 100ppm/°C; Power Rating: 125mW; Supplier 1: Digi-Key; RoHS: Yes; Category: Ceramic Capacitors; Stock 1: 54853; Pricing 1: 1=0,15000, 10=0,10900, 50=0,06160, 100=0,05100, 500=0,03578, 1000=0,02962 (USD); Mount: Surface Mount; Case/Package: 0805; Number of Pins: 2; Case Code (Metric): 2012; Case Code (Imperial): 0805; Weight: 0.000194oz; Min Operating Temperature: -55°C; Max Operating Temperature: 125°C; Packaging: Tape and Reel; Voltage Rating (DC): 50V; Termination: SMD/SMT; Construction: Flat; Package Quantity: 1; Resistor Type: Ceramic; Voltage: 50V; Series: C; Length: 2mm; Width: 0.049inch; Height: 0.85mm; Depth: 1.25mm; Thickness: 0.037inch; Radiation Hardening: No; RoHS Compliant: Yes; REACH SVHC: No SVHC; Lead Free: Lead Free; ComponentLink1URL: https://datasheet.ciiva.com/11788/0900766b80c1bb00-11788128.pdf?src-supplier=RSComponents; ComponentLink1Description: https://datasheet.ciiva.com/11788/0900766b80c1bb00-11788128.pdf?src-supplier=RSComponents; ComponentLink2URL: https://datasheet.ciiva.com/6250/tdkmlcccaprange-6250821.pdf?src-supplier=Digi-Key; ComponentLink2Description: https://datasheet.ciiva.com/6250/tdkmlcccaprange-6250821.pdf?src-supplier=Digi-Key; ComponentLink3URL: https://datasheet.ciiva.com/24191/e412-c-24191447.pdf?src-supplier=Future+Electronics; ComponentLink3Description: https://datasheet.ciiva.com/24191/e412-c-24191447.pdf?src-supplier=Future+Electronics; ComponentLink4URL: https://datasheet.ciiva.com/6250/tdkmlcccaprange-6250824.pdf?src-supplier=Digi-Key; ComponentLink4Description: https://datasheet.ciiva.com/6250/tdkmlcccaprange-6250824.pdf?src-supplier=Digi-Key; ComponentLink5URL: https://datasheet.ciiva.com/23803/1796654-23803035.pdf?src-supplier=Newark; ComponentLink5Description: https://datasheet.ciiva.com/23803/1796654-23803035.pdf?src-supplier=Newark; ComponentLink6URL: https://datasheet.ciiva.com/28602/1571323-28602204.pdf?src-supplier=Element14; ComponentLink6Description: https://datasheet.ciiva.com/28602/1571323-28602204.pdf?src-supplier=Element14; Supplier Part Number 1: 445-7534-1-ND; Supplier 2: Digi-Key; Stock 2: 3512962; Pricing 2: 1=0,10000, 10=0,04200, 100=0,01690, 1000=0,00759, 2500=0,00659 (USD); Size Code: 0805; Number of Terminations: 2; Max Power Dissipation: 125mW; Features: Moisture Resistant; Resistance Tolerance: 1%; Technology: THICK FILM; Military Standard: Not; Supplier Part Number 2: 311-10.0KCRCT-ND
R61-R64 = RES_330 OHM_5%_0805_1/8W: Res Thick Film 0805 330 Ohm 5% 0.125W(1/8W) ±100ppm/C Pad SMD Automotive T/R; Manufacturer: TE Connectivity; Manufacturer Part Number: CRGCQ0805J330R; Supplier 1: Digi-Key; RoHS: Yes; Category: Chip SMD Resistors; Stock 1: 75221; Pricing 1: 1=0,10000, 10=0,04400, 100=0,01780, 1000=0,00798, 2500=0,00693 (USD); ComponentLink1URL: https://www.te.com/commerce/DocumentDelivery/DDEController?Action=srchrtrv&amp;DocNm=1773204-3&amp;DocType=DS&amp;DocLang=English&src-supplier=Digi-Key; ComponentLink1Description: https://www.te.com/commerce/DocumentDelivery/DDEController?Action=srchrtrv&amp;DocNm=1773204-3&amp;DocType=DS&amp;DocLang=English&src-supplier=Digi-Key; Supplier Part Number 1: A130131CT-ND
SW3 SW4 = SWITCH_TACTILE_SPST-NO_0.05A_12V: Switch Tactile N.O. SPST Round Button Gull Wing 0.05A 12VDC 100000Cycles 1.27N SMD T/R; Manufacturer: ITT C&K; Manufacturer Part Number: PTS645SL43SMTR92LFS; Actuator Material: Nylon,Polyamide,PA66; Max Voltage Rating (DC): 12V; Contact Resistance: 100mR; Max Current Rating: 50mA; Illumination Type: Non-Illuminated; Switch Function: Off-Mom; Actuator Type: Standard; Actuator Length: 0.85mm; Supplier 1: Digi-Key; RoHS: Yes; Category: Tactile Switches; Stock 1: 52166; Pricing 1: 1=0,15000, 10=0,14900, 25=0,14160, 100=0,12870, 250=0,12104, 500=0,11072 (USD); Mount: Surface Mount; Contact Material: Bronze,Brass,Silver; Contact Plating: Silver; Mechanical Life: 100000Cycles; Color: Black; Min Operating Temperature: -20°C; Max Operating Temperature: 60°C; Throw Configuration: SPST; Operating Force: 1.27N; Packaging: Tape and Reel; Termination: Gull Wing; Voltage Rating (DC): 12V; Package Quantity: 1000; Current Rating: 50mA; Orientation: Straight; Series: PTS645; Length: 6mm; Depth: 9mm; Size: 6mm; Lead Free: Lead Free; RoHS Compliant: Yes; ComponentLink1URL: https://datasheet.ciiva.com/26927/getdatasheetpartid-774114-26927132.pdf?src-supplier=Verical; ComponentLink1Description: https://datasheet.ciiva.com/26927/getdatasheetpartid-774114-26927132.pdf?src-supplier=Verical; Supplier Part Number 1: CKN10880CT-ND
U12 = IC_MCU_STM32F407VGT6: MCU 32-bit STM32F ARM Cortex M4F RISC 1024KB Flash 2.5V/3.3V 100-Pin LQFP Tray; Manufacturer: STMicroelectronics; Interface: I2C,SPI,CAN,I2S,UART,USB,Ethernet,IrDA,USART,LIN,EBI/EMI; Number of I/Os: 82; Number of Timers/Counters: 14; Frequency: 168MHz; RAM Size: 196KB; Number of ADC Channels: 16; Number of PWM Channels: 2; Number of Ethernet Channels: 1; Max Supply Voltage: 3.6V; Min Supply Voltage: 1.8V; Data Bus Width: 32b; Oscillator Type: Internal; Number of SPI Channels: 3; Watchdog Timer: Yes; Peripherals: Brown-out Detect/Reset,POR,PWM,WDT,DMA,LCD,I2C; Supplier 1: Digi-Key; Supplier 2: Avnet; Supplier 3: Avnet; Supplier 4: Arrow Electronics; Supplier 5: Mouser; Supplier 6: Farnell; Manufacturer Part Number: STM32F407VGT6; RoHS: Yes; Category: Microcontrollers; Pricing 1: 1=16,21000, 10=14,90000, 25=14,28280, 90=12,86744 (USD); Case/Package: LQFP; Number of Pins: 100; Min Operating Temperature: -40°C; Max Operating Temperature: 85°C; Package Quantity: 90; Number of UART Channels: 2; Packaging: Tray; Number of Programmable I/O: 82; Max Frequency: 168MHz; Number of I2C Channels: 3; Address Bus Width: 32b; Memory Type: FLASH; Memory Size: 1024KB; Core Architecture: ARM; Series: STM32 F4; Length: 14.2mm; Width: 14.2mm; Height: 1.45mm; Radiation Hardening: No; REACH SVHC: No SVHC; Lead Free: Lead Free; RoHS Compliant: Yes; ComponentLink1URL: https://datasheet.ciiva.com/14132/stm32f407vgt6-tds-eng-14132567.pdf?src-supplier=Distrelec; ComponentLink1Description: https://datasheet.ciiva.com/14132/stm32f407vgt6-tds-eng-14132567.pdf?src-supplier=Distrelec; ComponentLink2URL: https://datasheet.ciiva.com/4842/dm00037051-492832-4842280.pdf?src-supplier=Mouser; ComponentLink2Description: https://datasheet.ciiva.com/4842/dm00037051-492832-4842280.pdf?src-supplier=Mouser; ComponentLink3URL: https://datasheet.ciiva.com/48687/001075599-da-01-en-mcu-32bt-1mb-stm32f407vgt6-lqfp-100-stm-48687547.pdf?src-supplier=Conrad; ComponentLink3Description: https://datasheet.ciiva.com/48687/001075599-da-01-en-mcu-32bt-1mb-stm32f407vgt6-lqfp-100-stm-48687547.pdf?src-supplier=Conrad; Supplier Part Number 1: 497-11605-ND; Supplier Part Number 2: 73T2333; Supplier Part Number 3: STM32F407VGT6; Supplier Part Number 4: STM32F407VGT6; Supplier Part Number 5: 511-STM32F407VGT6; Supplier Part Number 6: 2064368
X2 = CRYSTAL_25.0000MHZ_10PF_SMD: Crystal 25MHz ±30ppm (Tol) ±30ppm (Stability) 10pF FUND 60Ohm 4-Pin Ultra Mini-CSMD T/R; Manufacturer: Abracon; Manufacturer Part Number: ABM8G-25.000MHZ-4Y-T3; ESR (Equivalent Series Resistance): 60R; Supplier 1: Digi-Key; RoHS: Yes; Category: Crystals; Stock 1: 68858; Pricing 1: 1=0,67000, 10=0,59600, 50=0,55720, 100=0,49250, 500=0,46656, 1000=0,38880 (USD); Mount: Surface Mount; Case/Package: CSMD; Number of Pins: 4; Min Operating Temperature: -10°C; Max Operating Temperature: 60°C; Frequency: 25MHz; Frequency Tolerance: 30ppm; Load Capacitance: 10pF; Packaging: Tape and Reel; Series Resistance: 60R; Frequency Stability: 30ppm; Length: 3.2mm; Width: 0.098inch; Height: 0.039inch; Depth: 2.5mm; REACH SVHC: No SVHC; ComponentLink1URL: https://datasheet.ciiva.com/15116/getdatasheetpartid-722344-15116840.pdf?src-supplier=Verical; ComponentLink1Description: https://datasheet.ciiva.com/15116/getdatasheetpartid-722344-15116840.pdf?src-supplier=Verical; ComponentLink2URL: https://datasheet.ciiva.com/854/abm8g-854869.pdf?src-supplier=Digi-Key; ComponentLink2Description: https://datasheet.ciiva.com/854/abm8g-854869.pdf?src-supplier=Digi-Key; ComponentLink3URL: https://datasheet.ciiva.com/854/abm8g-854870.pdf?src-supplier=Digi-Key; ComponentLink3Description: https://datasheet.ciiva.com/854/abm8g-854870.pdf?src-supplier=Digi-Key; ComponentLink4URL: https://datasheet.ciiva.com/854/abm8g-854871.pdf?src-supplier=Digi-Key; ComponentLink4Description: https://datasheet.ciiva.com/854/abm8g-854871.pdf?src-supplier=Digi-Key; Supplier Part Number 1: 535-10915-1-ND